# EAGLE design display_v2 (EAGLE 5.06)
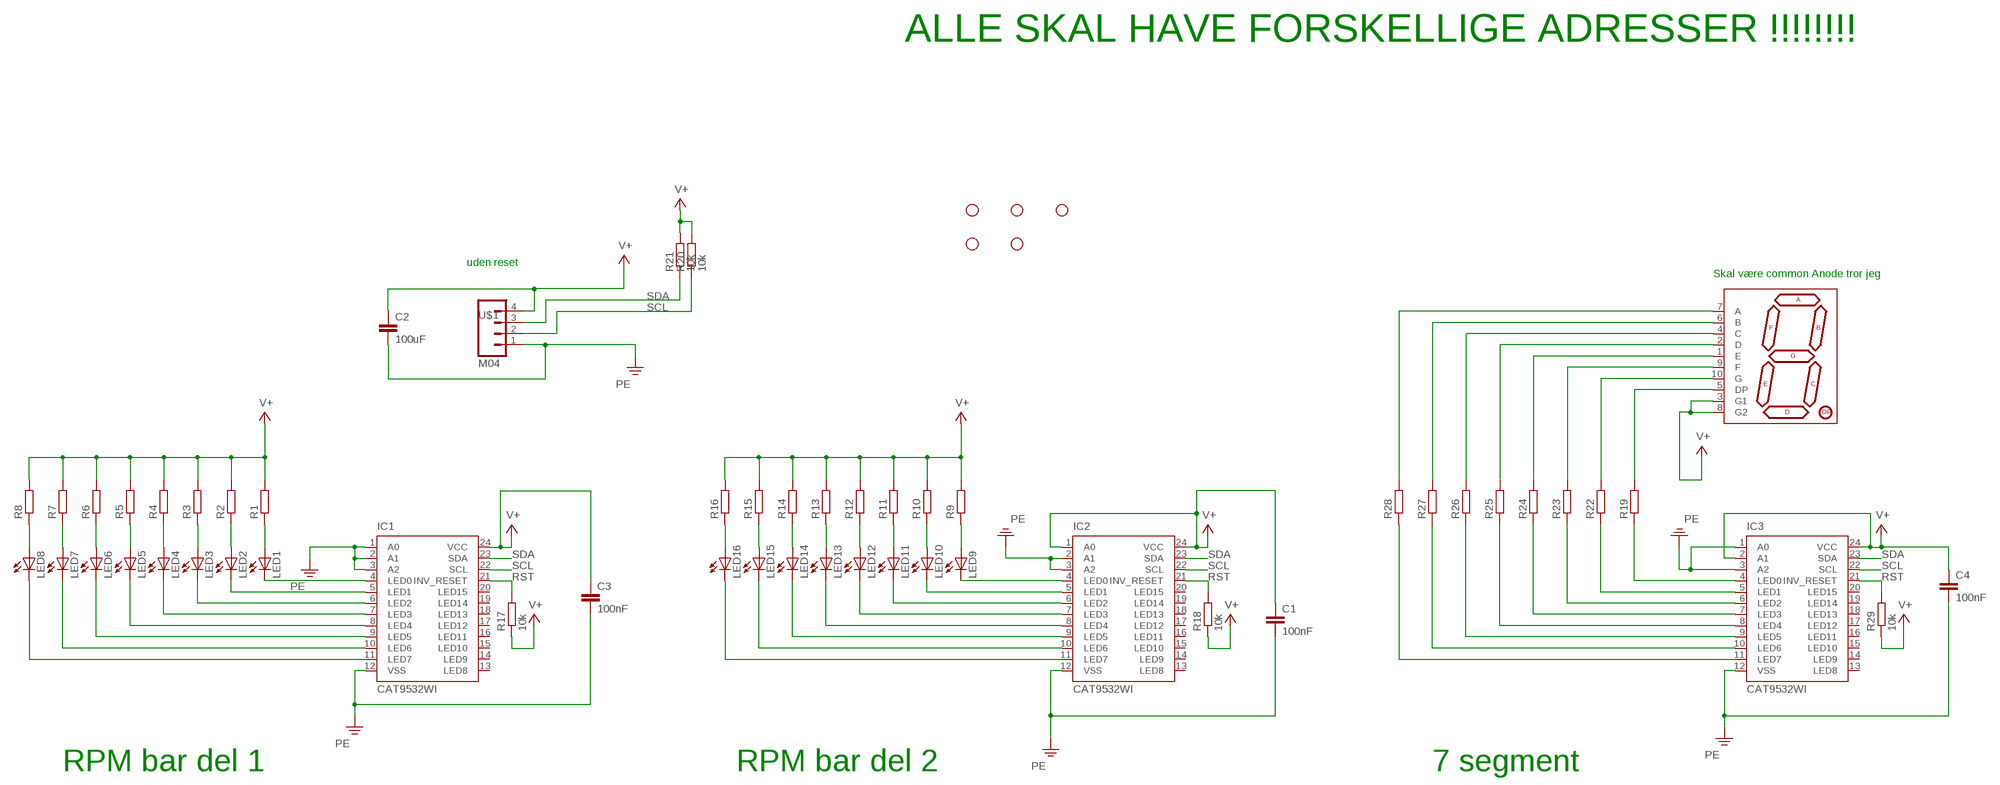
[diagram p0: schematic, sheet 1, part 1 of 2]
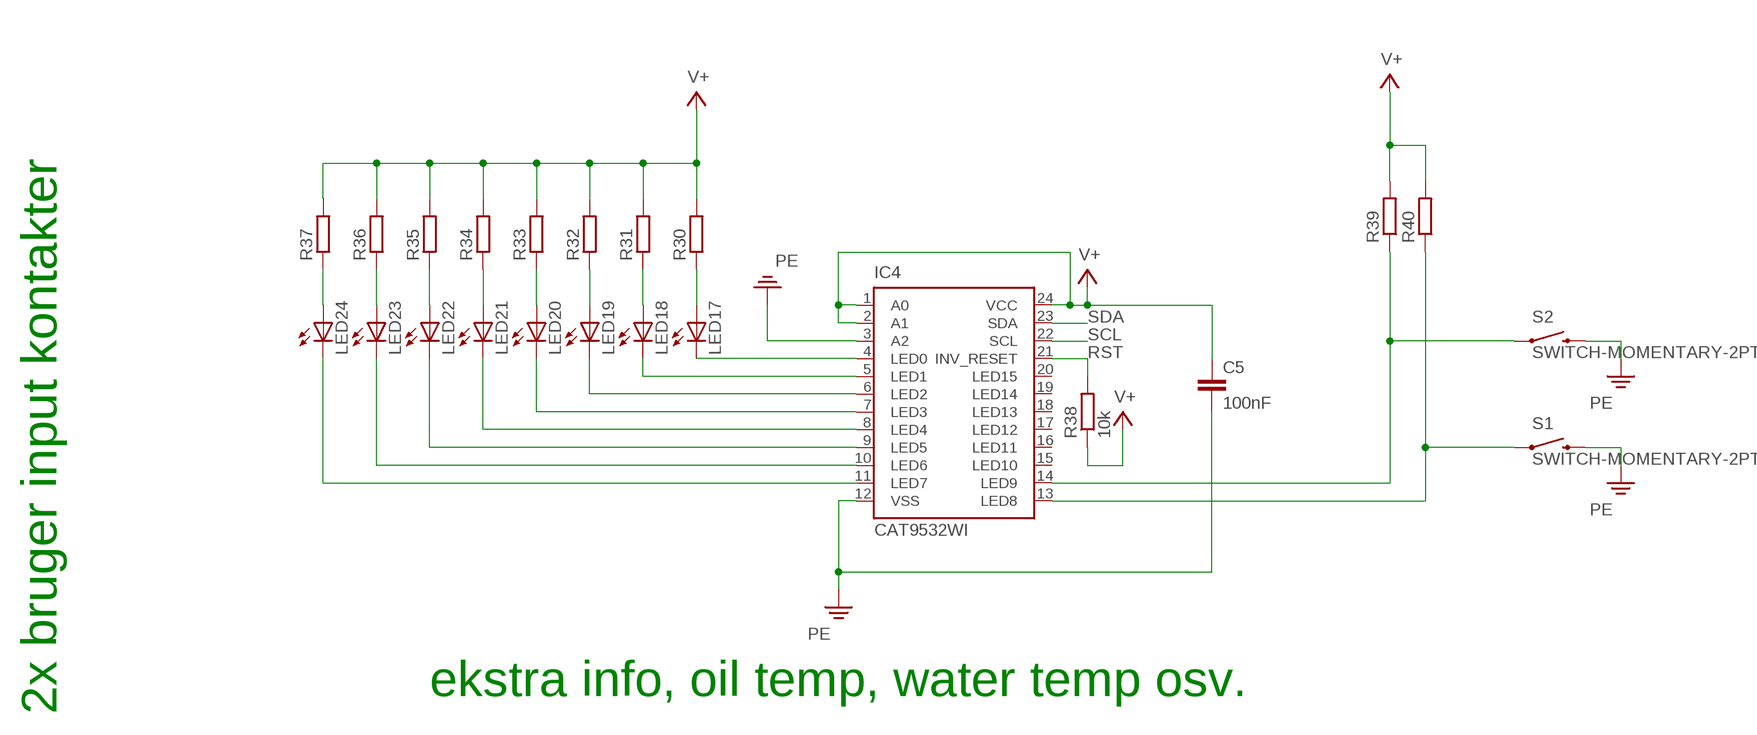
[diagram p1: schematic, sheet 1, part 2 of 2]

## Parts
C1  100nF  C-EUC0805K  [C0805K]
C2  100uF  C-EU102-064X133  [C102-064X133]
C3  100nF  C-EUC0805K  [C0805K]
C4  100nF  C-EUC0805K  [C0805K]
C5  100nF  C-EUC0805K  [C0805K]
IC1  CAT9532WI  [24SOIT]
IC2  CAT9532WI  [24SOIT]
IC3  CAT9532WI  [24SOIT]
IC4  CAT9532WI  [24SOIT]
JP1  STAND-OFF  [STAND-OFF]
JP2  STAND-OFF  [STAND-OFF]
JP3  STAND-OFF  [STAND-OFF]
JP4  STAND-OFF  [STAND-OFF]
JP5  STAND-OFF  [STAND-OFF]
LED1  LEDCHIPLED_1206  [CHIPLED_1206]
LED2  LEDCHIPLED_1206  [CHIPLED_1206]
LED3  LEDCHIPLED_1206  [CHIPLED_1206]
LED4  LEDCHIPLED_1206  [CHIPLED_1206]
LED5  LEDCHIPLED_1206  [CHIPLED_1206]
LED6  LEDCHIPLED_1206  [CHIPLED_1206]
LED7  LEDCHIPLED_1206  [CHIPLED_1206]
LED8  LEDCHIPLED_1206  [CHIPLED_1206]
LED9  LEDCHIPLED_1206  [CHIPLED_1206]
LED10  LEDCHIPLED_1206  [CHIPLED_1206]
LED11  LEDCHIPLED_1206  [CHIPLED_1206]
LED12  LEDCHIPLED_1206  [CHIPLED_1206]
LED13  LEDCHIPLED_1206  [CHIPLED_1206]
LED14  LEDCHIPLED_1206  [CHIPLED_1206]
LED15  LEDCHIPLED_1206  [CHIPLED_1206]
LED16  LEDCHIPLED_1206  [CHIPLED_1206]
LED17  LEDCHIPLED_1206  [CHIPLED_1206]
LED18  LEDCHIPLED_1206  [CHIPLED_1206]
LED19  LEDCHIPLED_1206  [CHIPLED_1206]
LED20  LEDCHIPLED_1206  [CHIPLED_1206]
LED21  LEDCHIPLED_1206  [CHIPLED_1206]
LED22  LEDCHIPLED_1206  [CHIPLED_1206]
LED23  LEDCHIPLED_1206  [CHIPLED_1206]
LED24  LEDCHIPLED_1206  [CHIPLED_1206]
R1  R-EU_R0805  [R0805]
R2  R-EU_R0805  [R0805]
R3  R-EU_R0805  [R0805]
R4  R-EU_R0805  [R0805]
R5  R-EU_R0805  [R0805]
R6  R-EU_R0805  [R0805]
R7  R-EU_R0805  [R0805]
R8  R-EU_R0805  [R0805]
R9  R-EU_R0805  [R0805]
R10  R-EU_R0805  [R0805]
R11  R-EU_R0805  [R0805]
R12  R-EU_R0805  [R0805]
R13  R-EU_R0805  [R0805]
R14  R-EU_R0805  [R0805]
R15  R-EU_R0805  [R0805]
R16  R-EU_R0805  [R0805]
R17  10k  R-EU_R0805  [R0805]
R18  10k  R-EU_R0805  [R0805]
R19  R-EU_R0805  [R0805]
R20  10k  R-EU_R0805  [R0805]
R21  10k  R-EU_R0805  [R0805]
R22  R-EU_R0805  [R0805]
R23  R-EU_R0805  [R0805]
R24  R-EU_R0805  [R0805]
R25  R-EU_R0805  [R0805]
R26  R-EU_R0805  [R0805]
R27  R-EU_R0805  [R0805]
R28  R-EU_R0805  [R0805]
R29  10k  R-EU_R0805  [R0805]
R30  R-EU_R0805  [R0805]
R31  R-EU_R0805  [R0805]
R32  R-EU_R0805  [R0805]
R33  R-EU_R0805  [R0805]
R34  R-EU_R0805  [R0805]
R35  R-EU_R0805  [R0805]
R36  R-EU_R0805  [R0805]
R37  R-EU_R0805  [R0805]
R38  10k  R-EU_R0805  [R0805]
R39  R-EU_R0805  [R0805]
R40  R-EU_R0805  [R0805]
S1  SWITCH-MOMENTARY-2PTH  [TACTILE-PTH]
S2  SWITCH-MOMENTARY-2PTH  [TACTILE-PTH]
U$1  M04  [S4B-PH]
U$2  7-SEGMENT-DISPLAYPTH  [7-SEGMENT-DISPLAY]

## Nets
N$1: IC1.4(LED0) LED1.C
N$2: IC3.4(LED0) R19.1
N$3: IC1.5(LED1) LED2.C
N$4: IC1.6(LED2) LED3.C
N$5: IC1.7(LED3) LED4.C
N$6: IC1.8(LED4) LED5.C
N$7: IC1.9(LED5) LED6.C
N$8: IC1.10(LED6) LED7.C
N$9: IC1.11(LED7) LED8.C
N$10: IC3.5(LED1) R22.1
N$11: LED1.A R1.1
N$12: LED2.A R2.1
N$13: LED3.A R3.1
N$14: LED4.A R4.1
N$15: LED5.A R5.1
N$16: LED6.A R6.1
N$17: LED7.A R7.1
N$18: LED8.A R8.1
N$19: IC2.4(LED0) LED9.C
N$20: IC2.5(LED1) LED10.C
N$21: IC2.6(LED2) LED11.C
N$22: IC2.7(LED3) LED12.C
N$23: IC2.8(LED4) LED13.C
N$24: IC2.9(LED5) LED14.C
N$25: IC2.10(LED6) LED15.C
N$26: IC2.11(LED7) LED16.C
N$27: LED9.A R9.1
N$28: LED10.A R10.1
N$29: LED11.A R11.1
N$30: LED12.A R12.1
N$31: LED13.A R13.1
N$32: LED14.A R14.1
N$33: LED15.A R15.1
N$34: LED16.A R16.1
N$35: IC3.6(LED2) R23.1
N$36: IC3.7(LED3) R24.1
N$37: IC3.8(LED4) R25.1
N$38: IC3.9(LED5) R26.1
N$39: IC3.10(LED6) R27.1
N$40: IC3.11(LED7) R28.1
N$41: IC4.14(LED9) R39.1 S2.1
N$42: IC4.4(LED0) LED17.C
N$43: IC4.5(LED1) LED18.C
N$44: IC4.6(LED2) LED19.C
N$45: IC4.7(LED3) LED20.C
N$46: IC4.8(LED4) LED21.C
N$47: IC4.9(LED5) LED22.C
N$48: IC4.10(LED6) LED23.C
N$49: R27.2 U$2.6(B)
N$50: R19.2 U$2.5(DP)
N$51: R22.2 U$2.10(G)
N$52: R23.2 U$2.9(F)
N$53: R24.2 U$2.1(E)
N$54: R25.2 U$2.2(D)
N$55: R26.2 U$2.4(C)
N$56: R28.2 U$2.7(A)
N$57: IC4.11(LED7) LED24.C
N$58: LED17.A R30.1
N$59: LED18.A R31.1
N$60: LED19.A R32.1
N$61: LED20.A R33.1
N$62: LED21.A R34.1
N$63: LED22.A R35.1
N$64: IC4.13(LED8) R40.1 S1.1
N$65: LED23.A R36.1
N$66: LED24.A R37.1
PE: C1.2 C2.2 C3.2 C4.2 C5.2 IC1.1(A0) IC1.2(A1) IC1.3(A2) IC1.12(VSS) IC2.2(A1) IC2.3(A2) IC2.12(VSS) IC3.1(A0) IC3.3(A2) IC3.12(VSS) IC4.3(A2) IC4.12(VSS) S1.3 S2.3 U$1.1
RST: IC1.21(INV_RESET) IC2.21(INV_RESET) IC3.21(INV_RESET) IC4.21(INV_RESET) R17.2 R18.2 R29.2 R38.2
SCL: IC1.22(SCL) IC2.22(SCL) IC3.22(SCL) IC4.22(SCL) R20.1 U$1.2
SDA: IC1.23(SDA) IC2.23(SDA) IC3.23(SDA) IC4.23(SDA) R21.1 U$1.3
V+: C1.1 C2.1 C3.1 C4.1 C5.1 IC1.24(VCC) IC2.1(A0) IC2.24(VCC) IC3.2(A1) IC3.24(VCC) IC4.1(A0) IC4.2(A1) IC4.24(VCC) R1.2 R2.2 R3.2 R4.2 R5.2 R6.2 R7.2 R8.2 R9.2 R10.2 R11.2 R12.2 R13.2 R14.2 R15.2 R16.2 R17.1 R18.1 R20.2 R21.2 R29.1 R30.2 R31.2 R32.2 R33.2 R34.2 R35.2 R36.2 R37.2 R38.1 R39.2 R40.2 U$1.4 U$2.3(G1) U$2.8(G2)
Unconnected: IC1.13(LED8) IC1.14(LED9) IC1.15(LED10) IC1.16(LED11) IC1.17(LED12) IC1.18(LED13) IC1.19(LED14) IC1.20(LED15) IC2.13(LED8) IC2.14(LED9) IC2.15(LED10) IC2.16(LED11) IC2.17(LED12) IC2.18(LED13) IC2.19(LED14) IC2.20(LED15) IC3.13(LED8) IC3.14(LED9) IC3.15(LED10) IC3.16(LED11) IC3.17(LED12) IC3.18(LED13) IC3.19(LED14) IC3.20(LED15) IC4.15(LED10) IC4.16(LED11) IC4.17(LED12) IC4.18(LED13) IC4.19(LED14) IC4.20(LED15)

## Notes on the sheet
- ALLE SKAL HAVE FORSKELLIGE ADRESSER !!!!!!!!
- uden reset
- Skal være common Anode tror jeg
- ekstra info, oil temp, water temp osv.
- 2x bruger input kontakter
- RPM bar del 1 | RPM bar del 2 | 7 segment

## Library data of the parts
C1-C5 = rcl:C-EU: CAPACITOR, European symbol
IC1-IC4 = unicorn_v2:CAT9532WI: Encoder to Counter Interface Source: http://www.usdigital.com/products/ls7183-ls7184/ls7183 ls7184 Data Sheet.pdf
JP1-JP5 = SparkFun:STAND-OFF: Stand Off This is the mechanical footprint for a #4 phillips button head screw. Use the keepout ring to avoid running the screw head into surrounding components. SKU : PRT-00447
LED1-LED24 = led:LED: LED OSRAM: - CHIPLED LG R971, LG N971, LY N971, LG Q971, LY Q971, LO R971, LY R971 LH N974, LH R974 LS Q976, LO Q976, LY Q976 LO Q996 - Hyper CHIPLED LW Q18S LB Q993, LB Q99A, LB R99A - SideLED LS A670, LO A670, LY A670, LG A670, LP A670 LB A673, LV A673, LT A673, LW A673 LH A674 LY A675 LS A676, LA A676, LO A676, LY A676, LW A676 LS A679, LY A679, LG A679 - Hyper Micro SIDELED® LS Y876, LA Y876, LO Y876, LY Y876 LT Y87S - SmartLED LW L88C, LW L88S LB L89C, LB L89S, LG L890 LS L89K, LO L89K, LY L89K LS L896, LA L896, LO L896, LY L896 - TOPLED LS T670, LO T670, LY T670, LG T670, LP T670 LSG T670, LSP T670, LSY T670, LOP T670, LYG T670 LG T671, LOG T671, LSG T671 LB T673, LV T673, LT T673, LW T673 LH T674 LS T676, LA T676, LO T676, LY T676, LB T676, LH T676, LSB T676, LW T676 LB T67C, LV T67C, LT T67C, LS T67K, LO T67K, LY T67K, LW E67C LS E67B, LA E67B, LO E67B, LY E67B, LB E67C, LV E67C, LT E67C LW T67C LS T679, LY T679, LG T679 LS T770, LO T770, LY T770, LG T770, LP T770 LB T773, LV T773, LT T773, LW T773 LH T774 LS E675, LA E675, LY E675, LS T675 LS T776, LA T776, LO T776, LY T776, LB T776 LHGB T686 LT T68C, LB T68C - Hyper Mini TOPLED® LB M676 - Mini TOPLED Santana® LG M470 LS M47K, LO M47K, LY M47K Source: http://www.osram.convergy.de LUXEON: - LUMILED® LXK2-PW12-R00, LXK2-PW12-S00, LXK2-PW14-U00, LXK2-PW14-V00 LXK2-PM12-R00, LXK2-PM12-S00, LXK2-PM14-U00 LXK2-PE12-Q00, LXK2-PE12-R00, LXK2-PE12-S00, LXK2-PE14-T00, LXK2-PE14-U00 LXK2-PB12-K00, LXK2-PB12-L00, LXK2-PB12-M00, LXK2-PB14-N00, LXK2-PB14-P00, LXK2-PB14-Q00 LXK2-PR12-L00, LXK2-PR12-M00, LXK2-PR14-Q00, LXK2-PR14-R00 LXK2-PD12-Q00, LXK2-PD12-R00, LXK2-PD12-S00 LXK2-PH12-R00, LXK2-PH12-S00 LXK2-PL12-P00, LXK2-PL12-Q00, LXK2-PL12-R00 Source: www.luxeon.com KINGBRIGHT: KA-3528ASYC Source: www.kingbright.com
R1-R40 = rcl:R-EU_: RESISTOR, European symbol
S1 S2 = SparkFun:SWITCH-MOMENTARY-2
U$1 = unicorn_v2:M04
U$2 = SparkFun:7-SEGMENT-DISPLAY

## Board
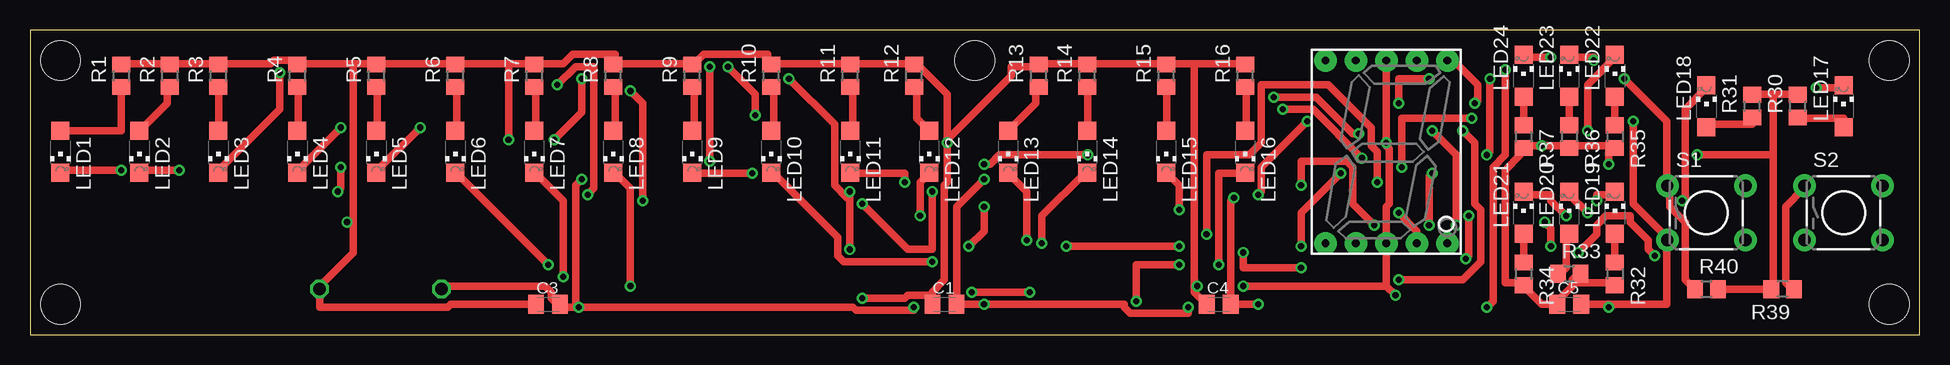
[diagram p2: board, top side]
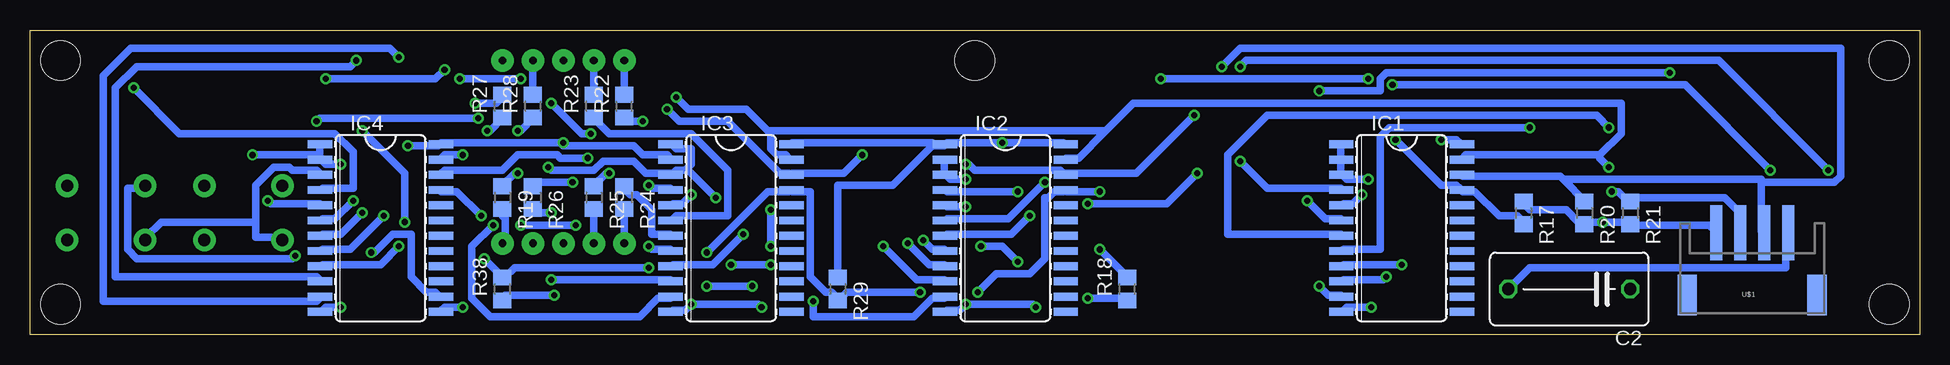
[diagram p3: board, bottom side, seen from below]

Size 157.48 x 25.4 mm. Coordinates in mm from the lower left corner, seen from the top.
Outline: 0,0 157.48,0 157.48,25.4 0,25.4 0,0
Copper layers (1*16): Top 0.035mm / dielectric 1.5mm / Bottom 0.035mm
Design rules "batchPCBrules": minimum track width 10mil, minimum drill 20mil, track to track 8mil, track to pad 8mil, pad to pad 8mil, via to via 8mil, smd to smd 8mil, copper to edge 40mil, drill to drill 8mil, minimum pad ring 10mil, minimum via ring 8mil, stop-mask expansion 4mil, vias tented up to drill 0mil, thermal gap 10mil

### Footprints (pad centres in the part's own frame; a part is rotated, then mirrored left to right if it is on the bottom)
C0805K = smd 1.3 x 1.6: 1 -1,0; 2 1,0
C102-064X133 = drill 1.016 octagon: 1 -5.08,0; 2 5.08,0
24SOIT = smd 0.66 x 2.032: 1 -6.985,-5.029; 2 -5.715,-5.029; 3 -4.445,-5.029; 4 -3.175,-5.029; 5 -1.905,-5.029; 6 -0.635,-5.029; 7 0.635,-5.029; 8 1.905,-5.029; 9 3.175,-5.029; 10 4.445,-5.029; 11 5.715,-5.029; 12 6.985,-5.029; 13 6.985,5.029; 14 5.715,5.029; 15 4.445,5.029; 16 3.175,5.029; 17 1.905,5.029; 18 0.635,5.029; 19 -0.635,5.029; 20 -1.905,5.029; 21 -3.175,5.029; 22 -4.445,5.029; 23 -5.715,5.029; 24 -6.985,5.029
STAND-OFF = hole 3.302: 0,0
CHIPLED_1206 = smd 1.5 x 1.5: A 0,-1.75; C 0,1.75
R0805 = smd 1.3 x 1.5: 1 -0.95,0; 2 0.95,0
TACTILE-PTH = drill 1.016 pad 1.88 round: 1 -3.251,2.261; 2 3.251,2.261; 3 -3.251,-2.261; 4 3.251,-2.261
S4B-PH = smd 1 x 4.6: 1 -3,-2.16; 2 -1,-2.16; 3 1,-2.16; 4 3,-2.16 | smd 1.6 x 3.4: NC1 -5.4,3.04; NC2 5.4,3.04
7-SEGMENT-DISPLAY = drill 0.65 pad 1.88 round: 1 -5.08,-7.62; 2 -2.54,-7.62; 3 0,-7.62; 4 2.54,-7.62; 5 5.08,-7.62; 6 5.08,7.62; 7 2.54,7.62; 8 0,7.62; 9 -2.54,7.62; 10 -5.08,7.62

### Placement (x,y rotation side)
C1  76.2,2.54 0 top
C2  29.21,3.81 180 bottom
C3  43.18,2.54 0 top
C4  99.06,2.54 0 top
C5  128.27,2.54 0 top
IC1  43.18,8.89 270 bottom
IC2  76.2,8.89 270 bottom
IC3  99.06,8.89 270 bottom
IC4  128.27,8.89 270 bottom
JP1  2.54,2.54 0 top
JP2  2.54,22.86 0 top
JP3  154.94,2.54 0 top
JP4  154.94,22.86 0 top
JP5  78.74,22.86 0 top
LED1  2.54,15.24 180 top
LED2  9.12,15.24 180 top
LED3  15.7,15.24 180 top
LED4  22.29,15.24 180 top
LED5  28.87,15.24 180 top
LED6  35.45,15.24 180 top
LED7  42.03,15.24 180 top
LED8  48.61,15.24 180 top
LED9  55.2,15.24 180 top
LED10  61.78,15.24 180 top
LED11  68.36,15.24 180 top
LED12  74.94,15.24 180 top
LED13  81.52,15.24 180 top
LED14  88.11,15.24 180 top
LED15  94.69,15.24 180 top
LED16  101.27,15.24 180 top
LED17  151.13,19.05 0 top
LED18  139.7,19.05 0 top
LED19  132.08,10.16 0 top
LED20  128.27,10.16 0 top
LED21  124.46,10.16 0 top
LED22  132.08,21.59 0 top
LED23  128.27,21.59 0 top
LED24  124.46,21.59 0 top
R1  7.62,21.59 90 top
R2  11.66,21.59 90 top
R3  15.7,21.59 90 top
R4  22.29,21.59 90 top
R5  28.87,21.59 90 top
R6  35.45,21.59 90 top
R7  42.03,21.59 90 top
R8  48.61,21.59 90 top
R9  55.2,21.59 90 top
R10  61.78,21.59 90 top
R11  68.36,21.59 90 top
R12  73.67,21.59 90 top
R13  84.06,21.59 90 top
R14  88.11,21.59 90 top
R15  94.69,21.59 90 top
R16  101.27,21.59 90 top
R17  33.02,10.16 270 bottom
R18  66.04,3.81 90 bottom
R19  118.11,11.43 270 bottom
R20  27.94,10.16 270 bottom
R21  24.13,10.16 270 bottom
R22  107.95,19.05 90 bottom
R23  110.49,19.05 90 bottom
R24  107.95,11.43 270 bottom
R25  110.49,11.43 270 bottom
R26  115.57,11.43 270 bottom
R27  118.11,19.05 90 bottom
R28  115.57,19.05 90 bottom
R29  90.17,3.81 270 bottom
R30  147.32,19.05 90 top
R31  143.51,19.05 90 top
R32  132.08,5.08 270 top
R33  128.27,5.08 0 top
R34  124.46,5.08 270 top
R35  132.08,16.51 270 top
R36  128.27,16.51 270 top
R37  124.46,16.51 270 top
R38  118.11,3.81 90 bottom
R39  146.05,3.81 180 top
R40  139.7,3.81 0 top
S1  139.7,10.16 0 top
S2  151.13,10.16 0 top
U$1  13.97,6.35 180 bottom
U$2  113.03,15.24 0 top

### Tracks (layer width: path | path; a pad name or v marks a point on that pad's centre or on a via)
N$1  (via drill 0.51)
  Top 0.635: v7.62,13.72 2.54,13.72 LED1.C | v56.64,22.35 v56.64,14.48
  Bottom 0.635: v7.62,13.72 16.76,22.86 56.13,22.86 v56.64,22.35 | v56.64,14.48 54.36,12.19 48.26,12.19 IC1.4
N$2  (via drill 0.51)
  Top 0.635: v116.84,13.46 116.59,13.21 v116.59,9.14 | v112.01,9.14 110.24,10.92 110.24,13.97 109.73,14.48 105.92,14.48 v105.92,12.45
  Bottom 0.635: v116.84,13.46 117.09,13.46 118.11,12.45 R19.1 | v112.01,9.14 v116.59,9.14 | v105.92,12.45 105.66,12.19 104.14,12.19 IC3.4
N$3  (via drill 0.51)
  Top 0.635: v12.45,13.72 9.14,13.72 LED2.C | v43.94,20.83 45.47,22.35 46.99,22.35 46.99,12.19 v46.48,11.68
  Bottom 0.635: v12.45,13.72 19.56,20.83 v43.94,20.83 | v46.48,11.68 47.24,10.92 48.01,10.92 IC1.5
N$4  (via drill 0.51)
  Top 0.635: v20.83,21.84 20.83,18.8 15.75,13.72 LED3.C | v50.04,20.32 51.05,19.3 v51.05,11.18
  Bottom 0.635: v20.83,21.84 44.45,21.84 44.96,21.34 44.96,20.32 v50.04,20.32 | v51.05,11.18 49.53,9.65 48.26,9.65 IC1.6
N$5  (via drill 0.51)
  Top 0.635: v25.91,17.27 22.35,13.72 LED4.C
  Bottom 0.635: v25.91,17.27 26.92,18.29 54.36,18.29 57.66,14.99 57.66,8.38 48.26,8.38 IC1.7
N$6  (via drill 0.51)
  Top 0.635: v32.51,17.27 28.96,13.72 LED5.C
  Bottom 0.635: v32.51,17.27 44.2,17.27 44.96,16.51 44.96,7.11 48.01,7.11 IC1.8
N$7  (via drill 0.51)
  Top 0.635: v43.18,5.84 35.56,13.46 LED6.C
  Bottom 0.635: v43.18,5.84 48.01,5.84 IC1.9
N$8  (via drill 0.51)
  Top 0.635: v44.45,4.83 44.45,11.18 42.16,13.46 LED7.C
  Bottom 0.635: v44.45,4.83 44.7,4.57 48.01,4.57 IC1.10
N$9  (via drill 0.51)
  Top 0.635: v50.04,4.06 50.04,12.19 48.77,13.46 LED8.C
  Bottom 0.635: v50.04,4.06 49.28,3.3 48.26,3.3 IC1.11
N$10  (via drill 0.51)
  Top 0.635: v106.43,17.78 102.62,13.97 102.62,11.94 v102.36,11.68
  Bottom 0.635: v106.43,17.78 107.7,17.78 107.95,18.03 R22.1 | v102.36,11.68 103.12,10.92 103.89,10.92 IC3.5
N$11
  Top 0.635: LED1.A 2.54,17.02 7.62,17.02 R1.1
N$12
  Top 0.635: LED2.A 9.14,17.02 11.43,19.3 11.43,20.57 R2.1
N$13
  Top 0.635: LED3.A 15.75,17.02 15.75,20.57 R3.1
N$14
  Top 0.635: LED4.A 22.35,17.02 22.35,20.57 R4.1
N$15
  Top 0.635: LED5.A 28.96,17.02 28.96,20.57 R5.1
N$16
  Top 0.635: LED6.A 35.56,17.02 35.56,20.57 R6.1
N$17
  Top 0.635: LED7.A 42.16,17.02 42.16,20.57 R7.1
N$18
  Top 0.635: LED8.A 48.77,17.02 48.77,20.57 R8.1
N$19  (via drill 0.51)
  Top 0.635: v60.2,13.46 55.37,13.46 LED9.C | v69.34,10.92 73.15,7.11 75.18,7.11 v75.18,11.94
  Bottom 0.635: v60.2,13.46 62.74,10.92 v69.34,10.92 | v75.18,11.94 81.03,11.94 IC2.4
N$20  (via drill 0.51)
  Top 0.635: v75.18,6.1 67.82,6.1 67.31,6.6 67.31,8.13 61.98,13.46 LED10.C | v78.23,7.37 79.5,8.64 v79.5,10.67
  Bottom 0.635: v75.18,6.1 76.45,7.37 v78.23,7.37 | v79.5,10.67 81.03,10.67 IC2.5
N$21  (via drill 0.51)
  Top 0.635: v72.9,12.7 72.9,13.46 68.58,13.46 LED11.C
  Bottom 0.635: v72.9,12.7 75.95,9.65 81.03,9.65 IC2.6
N$22  (via drill 0.51)
  Top 0.635: v74.17,9.91 74.17,12.7 74.93,13.46 LED12.C
  Bottom 0.635: v74.17,9.91 75.69,8.38 81.03,8.38 IC2.7
N$23  (via drill 0.51)
  Top 0.635: v83.06,7.87 83.06,11.94 81.53,13.46 LED13.C
  Bottom 0.635: v83.06,7.87 82.3,7.11 81.28,7.11 IC2.8
N$24  (via drill 0.51)
  Top 0.635: v84.33,7.62 84.33,9.91 87.88,13.46 LED14.C
  Bottom 0.635: v84.33,7.62 82.55,5.84 81.28,5.84 IC2.9
N$25  (via drill 0.51)
  Top 0.635: v95.76,10.41 95.76,12.45 94.74,13.46 LED15.C | v86.36,7.37 v95.76,7.37
  Bottom 0.635: v95.76,7.37 v95.76,10.41 | v86.36,7.37 83.57,4.57 81.28,4.57 IC2.10
N$26  (via drill 0.51)
  Top 0.635: v99.06,5.84 99.06,13.46 101.09,13.46 LED16.C | v95.76,5.84 92.2,5.84 v92.2,2.79
  Bottom 0.635: v95.76,5.84 v99.06,5.84 | v92.2,2.79 92.2,1.52 83.82,1.52 82.3,3.05 81.28,3.05 IC2.11
N$27
  Top 0.635: LED9.A 55.37,17.02 55.37,20.57 R9.1
N$28
  Top 0.635: LED10.A 61.98,17.02 61.98,20.57 R10.1
N$29
  Top 0.635: LED11.A 68.58,17.02 68.58,20.57 R11.1
N$30
  Top 0.635: LED12.A 74.93,17.02 73.91,18.03 73.91,20.57 R12.1
N$31
  Top 0.635: LED13.A 81.53,17.02 83.82,19.3 83.82,20.57 R13.1
N$32
  Top 0.635: LED14.A 88.14,17.02 88.14,20.57 R14.1
N$33
  Top 0.635: LED15.A 94.74,17.02 94.74,20.57 R15.1
N$34
  Top 0.635: LED16.A 101.35,17.02 101.35,20.57 R16.1
N$35
  Bottom 0.635: R23.1 110.49,18.03 109.22,16.76 102.36,16.76 99.31,13.72 99.31,9.91 103.63,9.91 103.89,9.65 IC3.6
N$36
  Bottom 0.635: R24.1 107.95,12.19 107.44,11.68 106.93,11.68 105.66,10.41 105.66,8.38 104.14,8.38 IC3.7
N$37  (via drill 0.51)
  Top 0.635: v109.22,13.46 105.92,10.16 v105.92,7.37
  Bottom 0.635: v109.22,13.46 109.47,13.46 110.49,12.45 R25.1 | v105.92,7.37 105.66,7.11 104.14,7.11 IC3.8
N$38  (via drill 0.51)
  Top 0.635: v112.27,12.7 112.27,15.24 111.76,15.75 111.76,17.27 108.2,20.83 102.62,20.83 102.62,16 101.6,14.99 98.04,14.99 v98.04,8.38
  Bottom 0.635: v112.27,12.7 115.32,12.7 115.57,12.45 R26.1 | v98.04,8.38 100.58,5.84 103.89,5.84 IC3.9
N$39  (via drill 0.51)
  Top 0.635: v119.38,17.02 120.4,16 120.4,10.92 120.9,10.41 120.9,6.1 119.38,4.57 v114.05,4.57
  Bottom 0.635: v119.38,17.02 119.13,17.02 118.11,18.03 R27.1 | v114.05,4.57 104.14,4.57 IC3.10
N$40  (via drill 0.51)
  Top 0.635: v116.84,17.02 118.87,14.99 v118.87,9.14
  Bottom 0.635: v116.84,17.02 116.59,17.02 115.57,18.03 R28.1 | v118.87,9.14 120.65,7.37 120.65,3.05 119.13,1.52 106.68,1.52 105.16,3.05 104.14,3.05 IC3.11
N$41  (via drill 0.51)
  Top 0.635: R39.1 146.81,3.81 146.3,4.32 146.3,10.67 147.83,12.19 S2.1 | v129.03,6.86 130.56,8.38 130.56,9.14 131.32,9.91 133.35,9.91 133.35,9.4 134.87,7.87 134.87,7.11 v135.38,6.6
  Bottom 0.635: v129.03,6.86 128.78,6.86 127.25,8.38 125.73,8.38 125.73,4.83 124.46,3.56 123.7,3.56 123.44,3.3 IC4.14 | v135.38,6.6 135.64,6.35 148.59,6.35 149.35,7.11 149.35,12.19 148.08,12.19 S2.1
N$42  (via drill 0.51)
  Top 0.635: v148.84,20.57 151.13,20.57 LED17.C
  Bottom 0.635: v148.84,20.57 145.03,16.76 132.08,16.76 130.56,15.24 130.56,12.19 133.1,12.19 IC4.4
N$43  (via drill 0.51)
  Top 0.635: v137.67,11.18 137.92,11.43 137.92,18.8 139.7,20.57 LED18.C
  Bottom 0.635: v137.67,11.18 137.41,10.92 133.35,10.92 IC4.5
N$44  (via drill 0.51)
  Top 0.635: v130.56,11.18 130.56,11.68 132.08,11.68 LED19.C
  Bottom 0.635: v130.56,11.18 132.08,9.65 133.1,9.65 IC4.6
N$45  (via drill 0.51)
  Top 0.635: v129.79,10.16 128.27,11.68 LED20.C
  Bottom 0.635: v129.79,10.16 131.57,8.38 133.1,8.38 IC4.7
N$46  (via drill 0.51)
  Top 0.635: v128.02,9.91 126.75,11.18 126.75,11.68 124.46,11.68 LED21.C
  Bottom 0.635: v128.02,9.91 130.81,7.11 133.1,7.11 IC4.8
N$47  (via drill 0.51)
  Top 0.635: v129.79,17.02 129.79,20.83 132.08,23.11 LED22.C | v126.24,9.4 126.75,8.89 v126.75,7.37
  Bottom 0.635: v129.79,17.02 126.24,13.46 v126.24,9.4 | v126.75,7.37 128.27,5.84 133.1,5.84 IC4.9
N$48  (via drill 0.51)
  Top 0.635: v130.3,22.86 130.3,23.11 128.27,23.11 LED23.C
  Bottom 0.635: v130.3,22.86 130.81,22.35 148.59,22.35 150.37,20.57 150.37,4.83 133.6,4.83 133.35,4.57 IC4.10
N$49  (via drill 0.51)
  Top 0.635: v120.4,19.3 120.65,19.56 120.65,20.83 118.62,22.86 U$2.6
  Bottom 0.635: v120.4,19.3 118.62,19.3 118.11,19.81 R27.2
N$50
  Bottom 0.635: U$2.5 117.86,7.62 117.86,9.65 118.11,9.91 R19.2
N$51
  Bottom 0.635: R22.2 U$2.10
N$52
  Bottom 0.635: R23.2 U$2.9
N$53
  Bottom 0.635: U$2.1 R24.2
N$54
  Bottom 0.635: U$2.2 R25.2
N$55  (via drill 0.51)
  Top 0.635: v114.05,10.16 115.57,8.64 U$2.4
  Bottom 0.635: v114.05,10.16 115.32,10.16 115.57,10.41 R26.2
N$56
  Bottom 0.635: R28.2 U$2.7
N$57  (via drill 0.51)
  Top 0.635: v126.75,23.11 124.46,23.11 LED24.C
  Bottom 0.635: v126.75,23.11 127.51,23.88 149.1,23.88 151.38,21.59 151.38,2.79 133.6,2.79 133.35,3.05 IC4.11
N$58
  Top 0.635: R30.1 147.32,18.03 151.13,18.03 LED17.A
N$59
  Top 0.635: LED18.A 139.7,17.53 143.51,17.53 R31.1
N$60
  Top 0.635: R32.1 LED19.A
N$61
  Top 0.635: R33.1 127.51,5.08 128.02,5.59 128.02,8.13 128.27,8.38 LED20.A
N$62
  Top 0.635: R34.1 LED21.A
N$63
  Top 0.635: R35.1 LED22.A
N$64  (via drill 0.51)
  Top 0.635: R40.1 138.68,3.81 137.92,4.57 137.92,9.4 136.65,10.67 136.65,12.19 S1.1 136.4,12.7 136.4,17.78 v132.84,21.34 | v121.41,2.29 121.92,2.79 121.92,13.97 122.94,14.99 v122.94,22.1
  Bottom 0.635: v121.41,2.29 122.94,2.29 123.19,2.03 IC4.13 | v122.94,22.1 123.7,21.34 v132.84,21.34
N$65
  Top 0.635: R36.1 LED23.A
N$66
  Top 0.635: R37.1 LED24.A
PE  (via drill 0.51)
  Top 0.635: C2.2 34.29,4.06 42.93,4.06 43.43,3.56 43.43,3.05 43.94,2.54 C3.2 44.2,2.29 v45.72,2.29 | v45.97,12.95 45.47,12.45 45.47,2.54 v45.72,2.29 | 131.57,2.54 136.4,2.54 136.4,7.87 S1.3 136.4,8.13 133.6,10.92 v133.6,17.78 | 131.57,2.54 C5.2 | 131.57,2.54 v131.57,2.29 | v79.5,12.95 77.22,10.67 77.22,2.79 C1.2 v79.5,2.54 91.19,2.54 91.19,2.29 91.69,1.78 96.52,1.78 v96.52,2.29 | v102.36,2.54 C4.2 100.08,2.79 100.08,11.18 v100.33,11.43 | v120.14,18.03 114.3,18.03 v114.3,13.97 | v73.66,2.29 73.66,2.03 68.83,2.03 68.58,2.29 v45.72,2.29
  Bottom 0.635: IC1.1 48.26,15.75 48.26,14.73 IC1.2 48.26,14.48 48.26,13.46 IC1.3 48.01,13.21 47.75,12.95 v45.97,12.95 | v45.72,2.29 47.75,2.29 48.01,2.03 IC1.12 | C2.2 32.51,5.59 11.18,5.59 11.18,8.38 U$1.1 | v131.57,2.29 132.84,2.29 133.1,2.03 IC4.12 | 138.68,9.4 138.68,8.13 136.65,8.13 S1.3 | 138.68,9.4 138.68,12.45 137.16,13.97 135.89,13.97 135.64,13.72 133.6,13.72 133.35,13.46 IC4.3 | S2.3 147.83,8.13 146.56,9.4 138.68,9.4 | IC2.2 81.28,14.48 81.28,13.46 IC2.3 81.03,13.21 80.77,12.95 v79.5,12.95 | IC2.12 81.03,2.03 80.01,2.03 v79.5,2.54 73.91,2.54 v73.66,2.29 | 102.87,13.72 103.63,13.72 103.89,13.46 IC3.3 104.14,13.46 106.17,13.46 107.19,14.48 109.73,14.48 110.49,13.72 114.05,13.72 v114.3,13.97 | 102.87,13.72 102.36,14.22 102.36,15.49 103.63,15.49 103.89,15.75 IC3.1 | IC3.12 103.89,2.03 102.87,2.03 v102.36,2.54 96.77,2.54 v96.52,2.29 | v100.33,11.43 102.62,13.72 102.87,13.72 | v133.6,17.78 133.35,18.03 v120.14,18.03
RST  (via drill 0.51)
  Top 0.635: v119.63,6.35 119.89,6.6 v119.89,9.91 | v105.92,5.59 101.09,5.59 v101.09,6.86 | 68.33,11.43 v68.33,11.94 | 68.33,11.43 v68.33,7.11 | v43.69,16.26 45.97,18.54 v45.97,21.34 | v63.25,21.34 67.06,17.53 67.06,12.45 68.07,11.43 68.33,11.43 | v78.49,3.56 v83.31,3.56
  Bottom 0.635: v119.63,6.35 118.11,4.83 R38.2 117.86,4.83 117.09,5.59 v105.92,5.59 | v119.89,9.91 121.92,11.94 123.19,11.94 IC4.21 | v101.09,6.86 96.01,11.94 94.23,11.94 IC3.21 93.98,11.94 92.46,11.94 92.46,4.83 91.19,3.56 90.68,3.56 90.17,3.05 R29.2 89.92,3.05 89.41,3.56 v83.31,3.56 | R17.2 33.02,9.4 33.53,9.91 35.05,9.91 37.08,11.94 38.1,11.94 IC1.21 38.35,12.19 38.61,12.45 39.88,12.45 v43.69,16.26 | v68.33,7.11 66.04,4.83 R18.2 | v68.33,11.94 71.12,11.94 IC2.21 71.37,11.94 72.14,11.94 72.64,11.43 72.9,11.43 72.9,6.35 74.17,5.08 76.96,5.08 v78.49,3.56 | v45.97,21.34 v63.25,21.34
SCL  (via drill 0.51)
  Top 0.635: v79.5,14.22 80.01,14.22 80.77,14.99 v88.14,14.99 | v111,14.73 106.93,18.8 v104.39,18.8 | v58.17,22.35 60.45,20.07 v60.45,18.29
  Bottom 0.635: 29.59,12.83 29.97,13.21 38.1,13.21 IC1.22 | 29.59,12.83 27.94,11.18 R20.1 | 13.21,12.7 13.21,12.95 29.46,12.95 29.59,12.83 | 13.21,12.7 13.21,8.64 U$1.2 | v79.5,14.22 79.25,14.22 78.74,13.72 71.63,13.72 71.37,13.46 IC2.22 71.12,13.46 65.28,13.46 v60.45,18.29 | v88.14,14.99 89.66,13.46 93.98,13.46 IC3.22 94.23,13.46 95,13.46 99.31,17.78 103.38,17.78 v104.39,18.8 | v111,14.73 113.28,14.73 113.54,14.99 116.84,14.99 118.11,13.72 122.94,13.72 123.19,13.46 IC4.22 | v58.17,22.35 56.64,23.88 6.6,23.88 6.6,13.21 7.11,12.7 13.21,12.7
SDA  (via drill 0.51)
  Top 0.635: v121.41,14.99 121.67,15.24 v121.67,21.34 | v116.59,21.34 114.05,21.34 v114.05,19.3 | v110.74,16.76 110.24,16.76 107.19,19.81 v103.63,19.81 | v25.65,11.94 25.91,12.19 v25.91,13.97
  Bottom 0.635: U$1.3 14.99,8.64 14.99,10.16 16.26,11.43 23.88,11.43 24.13,11.18 R21.1 24.38,11.18 25.15,11.94 v25.65,11.94 | 26.67,14.99 37.85,14.99 38.1,14.73 IC1.23 | 26.67,14.99 24.89,16.76 24.89,19.3 65.53,19.3 67.94,16.89 | 67.94,16.89 70.1,14.73 71.12,14.73 IC2.23 | 95.76,17.02 95.76,15.49 95.25,14.99 94.49,14.99 94.23,14.73 IC3.23 | 95.76,17.02 68.07,17.02 67.94,16.89 | v121.41,14.99 122.94,14.99 123.19,14.73 IC4.23 | v116.59,21.34 v121.67,21.34 | v114.05,19.3 111.51,16.76 v110.74,16.76 | v103.63,19.81 102.62,18.8 97.79,18.8 96.01,17.02 95.76,17.02 | v25.91,13.97 26.67,14.73 26.67,14.99
V+  (via drill 0.51)
  Top 0.635: 145.29,20.07 147.32,20.07 R30.2 | 145.29,20.07 143.51,20.07 R31.2 | R40.2 R39.2 145.29,4.06 145.29,14.99 | 145.29,14.99 145.29,20.07 | 128.52,4.32 128.52,4.06 127.25,2.79 C5.1 125.98,2.54 124.46,4.06 R34.2 124.21,4.32 122.94,4.32 122.94,13.72 124.21,14.99 124.21,15.49 R37.2 124.46,15.75 v125.98,15.75 128.27,15.75 R36.2 128.52,15.75 132.08,15.75 R35.2 131.57,15.49 v131.57,14.22 | 128.52,4.32 128.52,4.57 129.03,5.08 R33.2 | R32.2 132.08,4.32 128.52,4.32 | v138.94,14.99 145.29,14.99 | 113.03,4.06 v113.79,3.3 | 113.03,4.06 U$2.3 113.03,10.67 113.28,10.92 113.28,15.49 113.03,15.75 v113.03,16 U$2.8 | C3.1 35.05,2.54 34.8,2.29 24.13,2.29 C2.1 24.13,4.06 26.92,6.86 26.92,9.4 | R1.2 7.62,22.61 11.43,22.61 R2.2 11.94,22.61 15.49,22.61 R3.2 16,22.61 20.07,22.61 20.32,22.86 22.35,22.86 R4.2 22.35,22.61 26.92,22.61 | 26.92,22.61 28.7,22.61 R5.2 28.96,22.61 35.31,22.61 R6.2 35.56,22.61 39.88,22.61 | 39.88,22.61 41.91,22.61 R7.2 42.16,22.61 44.45,22.61 45.21,23.37 48.77,23.37 48.77,22.86 R8.2 48.77,22.61 55.12,22.61 R9.2 55.37,22.61 56.13,23.37 61.47,23.37 61.47,22.61 R10.2 61.98,22.61 68.33,22.61 R11.2 68.58,22.61 73.66,22.61 R12.2 73.91,22.61 76.45,20.07 76.45,16.51 | 39.88,22.61 v39.88,16.26 | 26.92,9.4 26.92,22.61 | v26.42,9.4 26.92,9.4 | 97.03,22.61 95,22.61 R15.2 94.49,22.61 88.39,22.61 R14.2 87.88,22.61 84.07,22.61 R13.2 83.82,22.35 81.79,22.35 81.79,21.59 76.71,16.51 76.45,16.51 | 97.03,22.61 101.09,22.61 R16.2 | 97.03,4.06 97.03,3.56 98.04,2.54 C4.1 | 97.03,22.61 97.03,4.06 | v69.34,3.05 72.9,3.05 73.15,3.3 75.18,3.3 | 75.18,3.3 75.18,2.54 C1.1 | 76.45,16.51 v76.45,16 76.45,12.7 76.2,12.45 76.2,4.57 75.18,3.56 75.18,3.3
  Top 0.635: v101.09,4.06 113.03,4.06 | 97.03,4.06 v97.28,4.06
  Bottom 0.635: 133.35,14.99 133.35,15.75 IC4.1 | 133.35,14.99 133.35,14.73 IC4.2 133.1,14.48 132.84,14.22 v131.57,14.22 | 133.35,14.99 v138.94,14.99 | 113.03,15.75 107.19,15.75 106.43,14.99 104.39,14.99 104.14,14.73 IC3.2 | 113.03,15.75 113.28,16 123.19,16 IC4.24 123.44,15.75 v125.98,15.75 | v113.79,3.3 117.86,3.3 118.11,3.05 R38.1 | v113.03,16 113.03,15.75 | R17.1 33.02,10.92 32.51,10.41 29.46,10.41 28.45,9.4 28.19,9.4 R20.2 27.94,9.4 v26.42,9.4 24.13,9.4 R21.2 23.88,9.14 17.53,9.14 17.02,8.64 U$1.4 | v39.88,16.26 38.61,16.26 38.35,16 IC1.24 | 82.3,15.75 85.6,12.45 90.17,12.45 R29.1 | 82.3,15.75 81.28,15.75 IC2.1 81.03,16 v76.45,16 71.37,16 IC2.24 | IC3.24 93.98,16 82.3,16 82.3,15.75 | v69.34,3.05 66.04,3.05 R18.1 | v97.28,4.06 v101.09,4.06